# Altium schematic sheet PhaseDriver.SchDoc: Phase Driver
size 292 x 193 mm; Revision: 1.0; SheetNumber: 2; SheetTotal: 2; Project: Inverter
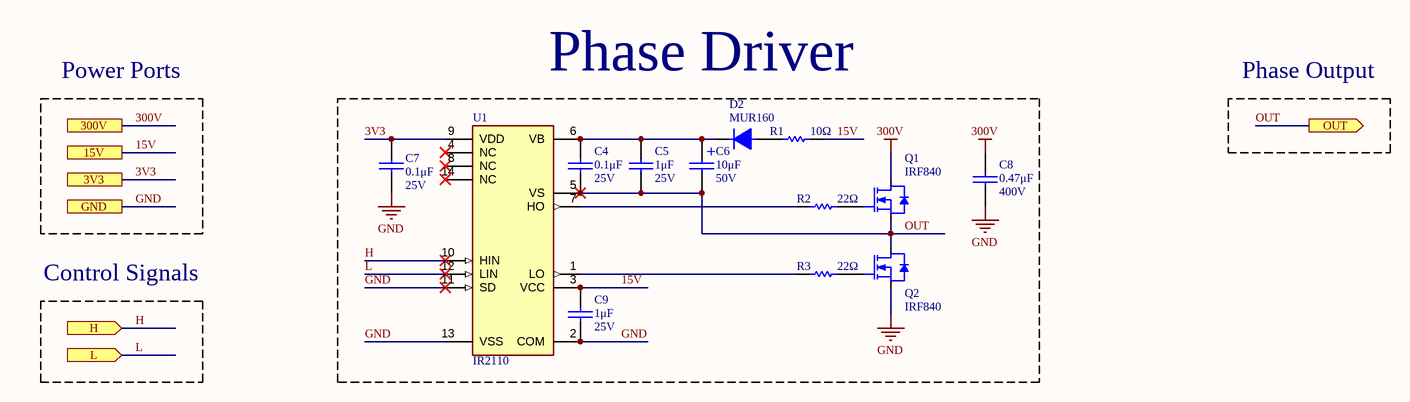
[diagram p0: PhaseDriver.SchDoc]

## Parts
C4  value 0.1μF  Voltage Rating: 25V  [0805]  (hidden comment: CAP)
C5  value 1μF  Voltage Rating: 25V  [CAP100]  (hidden comment: CAP)
C6  value 10μF  Voltage Rating: 50V  [CAP100RP]  (hidden comment: CAPPOL)
C7  value 0.1μF  Voltage Rating: 25V  [0805]  (hidden comment: CAP)
C8  value 0.47μF  Voltage Rating: 400V  [CAP600]  (hidden comment: CAP)
C9  value 1μF  Voltage Rating: 25V  [CAP100]  (hidden comment: CAP)
D2  MUR160  [DO41]
Q1  IRF840  [TO-220 V]
Q2  IRF840  [TO-220 V]
R1  value 10Ω  [0805]  (hidden comment: RES)
R2  value 22Ω  [0805]  (hidden comment: RES)
R3  value 22Ω  [0805]  (hidden comment: RES)
U1  IR2110  [IR2110]

## Blocks framed on the sheet
Phase Driver: C4-C9 D2 Q1 Q2 R1-R3 U1

## Ports
3V3, 15V, 300V, GND, H (in), L (in), OUT (out)

## Nets
300V: C8.1 Q1.2(D) ; port 300V
GND: C7.2 C8.2 C9.2 Q2.3(S) U1.2(COM) U1.11(SD) U1.13(VSS) ; port GND
3V3: C7.1 U1.9(VDD) ; port 3V3
15V: C9.1 R1.1 U1.3(VCC) ; port 15V
H: U1.10(HIN) ; port H
L: U1.12(LIN) ; port L
OUT: C4.2 C5.2 C6.2 Q1.3(S) Q2.2(D) U1.5(VS) ; port OUT
NetC4_1: C4.1 C5.1 C6.1 D2.2 U1.6(VB)
NetD2_1: D2.1 R1.2
NetQ1_1: Q1.1(G) R2.1
NetQ2_1: Q2.1(G) R3.1
NetR2_2: R2.2 U1.7(HO)
NetR3_2: R3.2 U1.1(LO)

Not connected (* = marked no-connect by the designer): U1 4(NC)* 8(NC)* 14(NC)*

## Notes on the sheet
- Power Ports
- Phase Output
- Control Signals
- Title
- Revision
- Date
- Author/s
- Group
- Sheet
- of
- File
- (in symbol CAPACITOR POLARIZADO) +

## Library data of the parts
C4 C5 C7-C9 = CAPACITOR: Manufacturer: -; Manufacturer Part Number: -
C6 = CAPACITOR POLARIZADO: Manufacturer Part Number: -; Manufacturer: -
Q1 Q2 = IRF840: Manufacturer: Vishay; Value: IRF840; Manufacturer Part Number: IRF840
R1-R3 = RESISTOR: Power: 1/10W; Manufacturer Part Number: -; Manufacturer: -
U1 = IR2110: High and Low Side Driver; Manufacturer: Infineon Technologies; PackageReference: PG-DIP-14-903; Manufacturer Order Number: IR2110
D2 = MUR160: Manufacturer: *; Manufacturer Part Number: MUR160